# EAGLE design PCB-PWR-CON3 (EAGLE 7.1.0)
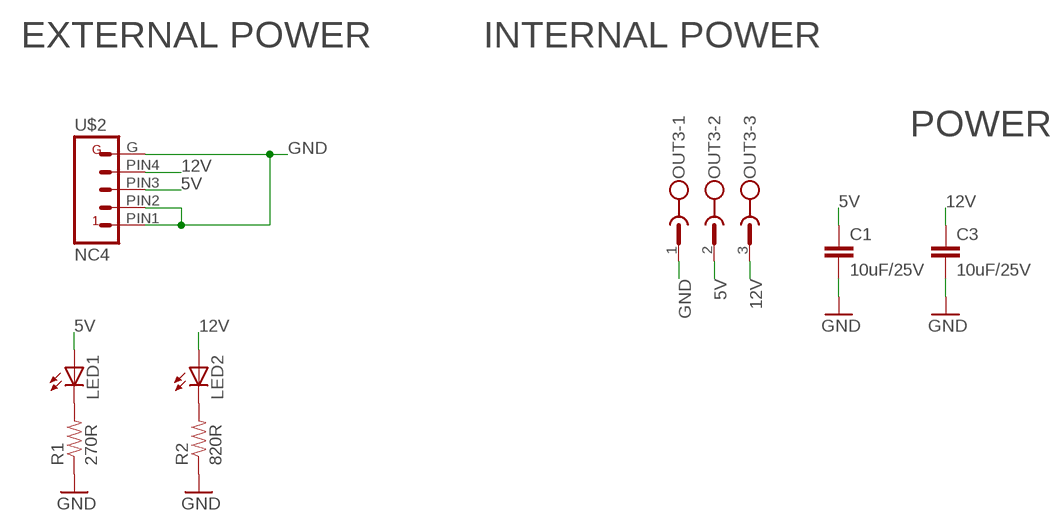
[diagram p0: schematic, sheet 1]

## Parts
C1  10uF/25V  CAP0805  [0805]
C3  10uF/25V  CAP0805  [0805]
LED1  LED3MM  [LED3MM]
LED2  LED3MM  [LED3MM]
OUT3  CON1  MSTBV3  [MSTBV3]
R1  270R  RESISTOR0603-RES  [0603-RES]
R2  820R  RESISTOR0603-RES  [0603-RES]
U$2  NC4  [NC4-MD-L1]

## Nets
5V [PWR]: C1.1 LED1.A OUT3.2 U$2.PIN3
12V [PWR]: C3.1 LED2.A OUT3.3 U$2.PIN4
GND [PWR]: C1.2 C3.2 OUT3.1 R1.1 R2.1 U$2.G U$2.PIN1 U$2.PIN2
N$1: LED1.K(C) R1.2
N$2: LED2.K(C) R2.2

## Notes on the sheet
- EXTERNAL POWER | INTERNAL POWER
- POWER

## Library data of the parts
C1 C3 = SparkFun:CAP: Capacitor Standard 0603 ceramic capacitor, and 0.1" leaded capacitor.
LED1 LED2 = SparkFun:LED: LEDs Standard schematic elements and footprints for 5mm, 3mm, 1206, and 0603 sized LEDs. 5mm - Spark Fun Electronics SKU : COM-00529 (and others)
OUT3 = con-phoenix-508:MSTBV3: PHOENIX; MPN: MSTBV 2,5/3-GF-5.08; OC_FARNELL: 1792793; OC_NEWARK: 69R9846
R1 R2 = SparkFun:RESISTOR: Resistor Basic schematic elements and footprints for 0603, 1206, and PTH resistors.
U$2 = SKAARHOJ:NC4

## Net classes
0 default: width 0.254 mm, drill 0.406 mm, clearance 0.254 mm
1 PWR: width 0.813 mm, drill 0.61 mm, clearance 0.254 mm

## Board
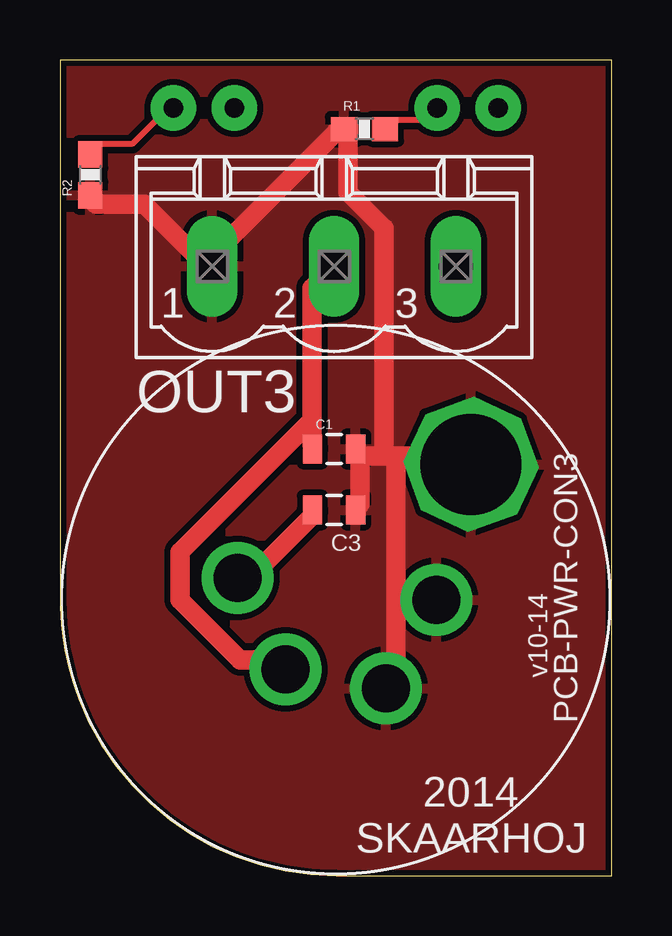
[diagram p1: board, top side]
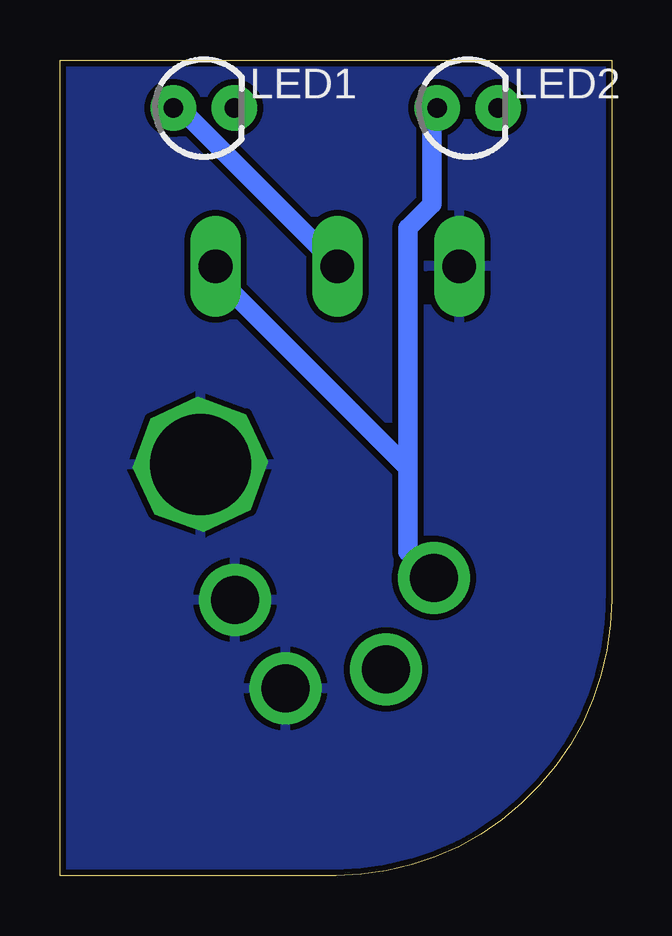
[diagram p2: board, bottom side, seen from below]

Size 23 x 34 mm. Coordinates in mm from the lower left corner, seen from the top.
Outline: 11.5,0 23,0 23,34 0,34 0,11.5 arc90 11.5,0
Copper layers (1*16): Top 0.035mm / dielectric 1.5mm / Bottom 0.035mm
Design rules "Fusion_eagle_rule_v1.1": minimum track width 6mil, minimum drill 12mil, track to track 6mil, track to pad 6mil, pad to pad 6mil, via to via 6mil, smd to smd 0mil, copper to edge 10mil, drill to drill 10mil, minimum pad ring 10mil, minimum via ring 6mil, stop-mask expansion 2mil, vias tented up to drill 100mil, thermal gap 10mil

### Footprints (pad centres in the part's own frame; a part is rotated, then mirrored left to right if it is on the bottom)
0805 = smd 0.8 x 1.2: 1 -0.9,0; 2 0.9,0
LED3MM = drill 0.813 pad 1.88: A -1.27,0; K 1.27,0
MSTBV3 = drill 1.397 long: 1 -5.08,0; 2 0,0; 3 5.08,0
0603-RES = smd 1.1 x 1: 1 -0.85,0; 2 0.85,0
NC4-MD-L1 = drill 4.2 octagon: G 5.64,5.64 | drill 2: PIN1 4.2,0; PIN2 2.1,-3.7; PIN3 -2.1,-2.9; PIN4 -4.1,0.9

### Placement (x,y rotation side)
C1  11.43,17.78 0 top
C3  11.43,15.24 0 top
LED1  17,32 0 bottom
LED2  6,32 0 bottom
OUT3  11.43,25.4 0 top
R1  12.7,31.11 0 top
R2  1.27,29.21 90 top
U$2  11.5,11.5 0 top

### Tracks (layer width: path | path; a pad name or v marks a point on that pad's centre or on a via)
5V
  Top 0.813: 10.5,19 10.5,24.5 11,25 OUT3.2 | 10.5,19 10.5,18 C1.1 | 10.5,19 5,13.5 5,11.5 7.5,9 9,9 U$2.PIN3
  Bottom 0.813: LED1.A 18,32 11.5,25.5 OUT3.2
12V
  Top 0.813: C3.1 10.5,15 7.5,12 U$2.PIN4
  Bottom 0.813: 8.5,17 8.5,13.5 U$2.PIN4 | 8.5,17 8.5,27 7.5,28 7.5,32 LED2.A | 8.5,17 16.5,25 OUT3.3
GND
  Top 0.813: 6,25.5 3.5,28 1.5,28 R2.1 | 6,25.5 11.5,31 R1.1 12,31 12,28.5 13.5,27 13.5,17.5 | 6,25.5 OUT3.1 | 12.5,17.5 12.5,15.5 C3.2 | 14,17.5 17,17.5 U$2.G | 14,17.5 13.5,17.5 | 13.5,17.5 12.5,17.5 | 12.5,17.5 C1.2 | 14,17.5 14,11.5 | 14,11.5 14,8 U$2.PIN2 | 14,11.5 U$2.PIN1
  pour Top: 0,0 22.86,0 22.86,34.29 0,34.29
  pour Bottom: 0,34.29 0,0 22.86,0 22.86,34.29
N$1
  Top 0.254: R1.2 14,31.5 15,31.5 15.5,32 LED1.K
N$2
  Top 0.254: R2.2 1.5,30.5 3,30.5 4.5,32 LED2.K

### Text on the board
_tsilk: v10-14 | PCB-PWR-CON3 | 2014 / SKAARHOJ